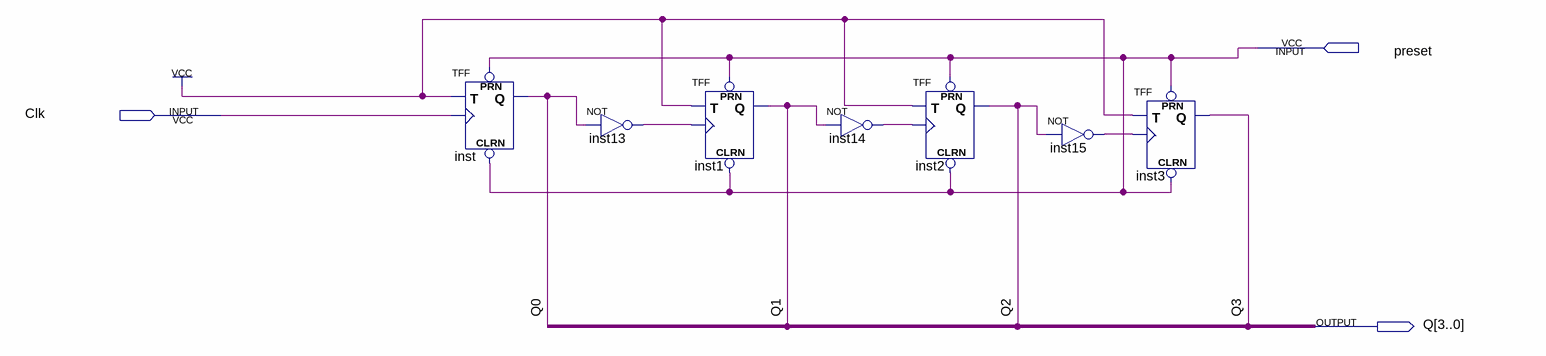
[diagram p0: schematic sheet]
// Quartus schematic lab10step3a.bdf as structural Verilog: 7 symbols, 3 pins
module lab10step3a (
  input  preset,
  input  Clk,
  output [3:0] Q
);

  wire inst13_out, inst14_out, inst15_out;

  TFF inst (.PRN(preset), .CLRN(preset), .T(1'b1), .CLK(Clk), .Q(Q[0]));
  not inst13 (inst13_out, Q[0]);
  TFF inst1 (.PRN(preset), .CLRN(preset), .T(1'b1), .CLK(inst13_out), .Q(Q[1]));
  not inst14 (inst14_out, Q[1]);
  TFF inst2 (.PRN(preset), .CLRN(preset), .T(1'b1), .CLK(inst14_out), .Q(Q[2]));
  not inst15 (inst15_out, Q[2]);
  TFF inst3 (.PRN(preset), .CLRN(preset), .T(1'b1), .CLK(inst15_out), .Q(Q[3]));
endmodule
